# Altium schematic sheet 2414-SAG13.SchDoc: =SchTitle
size 408 x 276 mm; Organization: ETML-ES; Address1: Rue de Sébeillon12; Address2: CH - 1004 Lausanne; Address3: Tél. 021 316 77 77; Address4: www.etml-es.ch; SheetNumber: 1; SheetTotal: 1; Replace: .; ModA: .; ModB: .; ModC: .; ModD: .

## Notes on the sheet
- a
- Dessiné
- A3
- Echelle :
- Mod.
- b
- c
- d
- Contrôlé
- Remplace
- Nb. feuilles
- Feuille n°
- Nom du projet
- No